# Altium project USBtoCANF3.PrjPCB
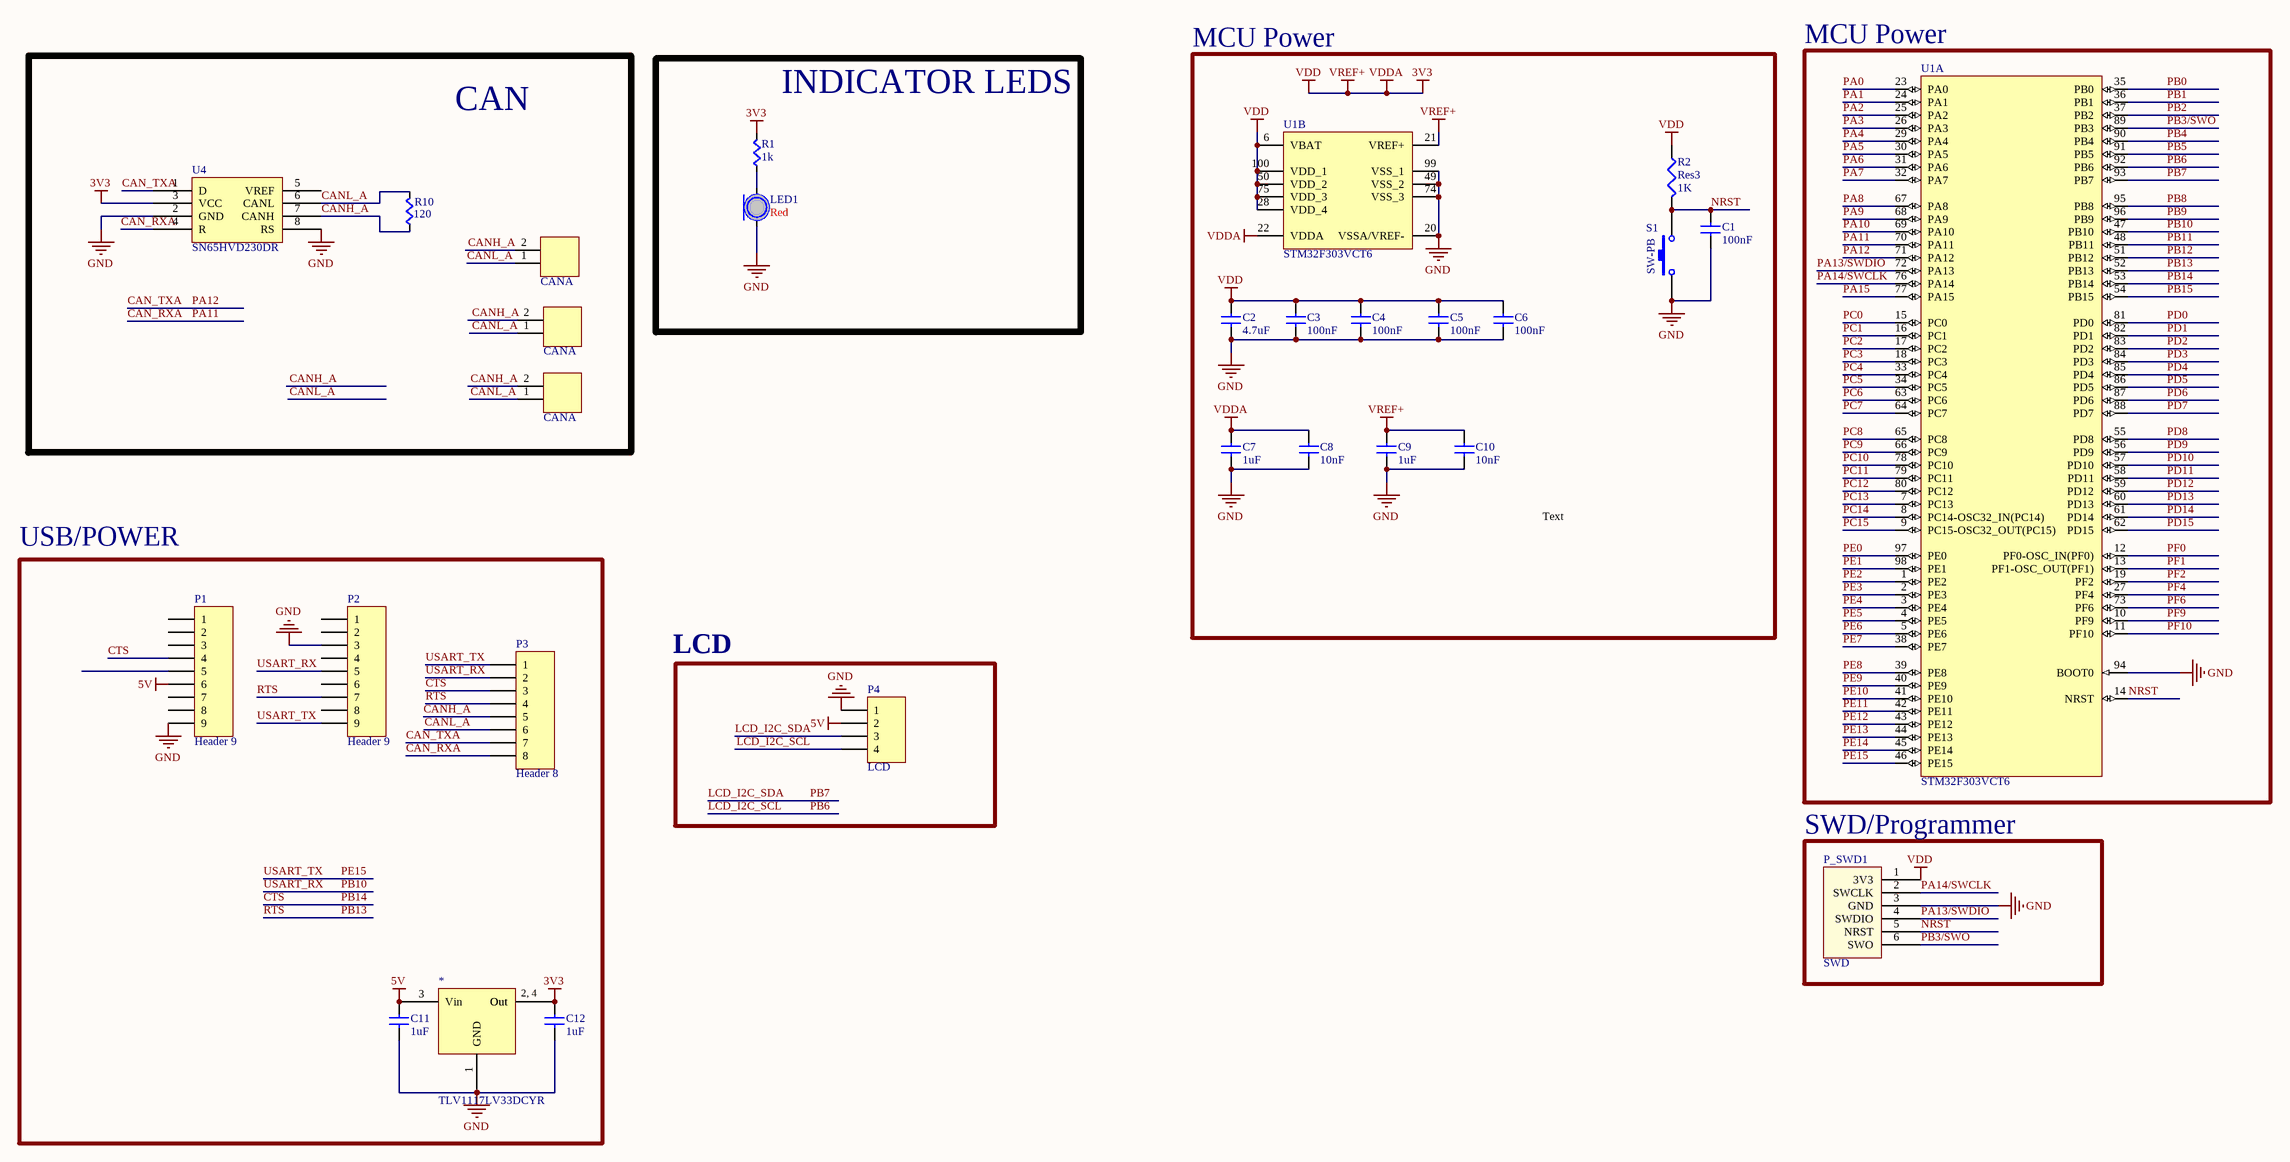
[diagram p0: USBtoCANF3.SchDoc]
1 sheet, 28 parts. Net scope: global (net labels, ports and power ports of the same name join across sheets).
Board file: USBtoCANF3.PcbDoc

## Sheet USBtoCANF3.SchDoc
size C

### Parts
(Parts that share a designator on the sheet are numbered #1, #2 ... from top to bottom, then left to right.)
*  TLV1117LV33DCYR  [SOT23-4N]
C1  value 100nF  [CAPC0603]  (hidden comment: Cap)
C2  value 4.7uF  [CAPC0603]  (hidden comment: Cap)
C3  value 100nF  [CAPC0603]  (hidden comment: Cap)
C4  value 100nF  [CAPC0603]  (hidden comment: Cap)
C5  value 100nF  [CAPC0603]  (hidden comment: Cap)
C6  value 100nF  [CAPC0603]  (hidden comment: Cap)
C7  value 1uF  [CAPC0603]  (hidden comment: Cap)
C8  value 10nF  [CAPC0603]  (hidden comment: Cap)
C9  value 1uF  [CAPC0603]  (hidden comment: Cap)
C10  value 10nF  [CAPC0603]  (hidden comment: Cap)
C11  value 1uF  [CAPC0603]  (hidden comment: Cap)
C12  value 1uF  [CAPC0603]  (hidden comment: Cap)
CANA#1  2-pin Horz Sherlock  [MOLEX-HDR-1X2-SHERLOCK-HORZ]  (value not drawn)
CANA#2  2-pin Horz Sherlock  [MOLEX-HDR-1X2-SHERLOCK-HORZ]  (value not drawn)
CANA#3  2-pin Horz Sherlock  [MOLEX-HDR-1X2-SHERLOCK-HORZ]  (value not drawn)
LED1  Color: Red  [LED0603]  (hidden comment: LED)
P1  Header 9  [HDR1X9]
P2  Header 9  [HDR1X9]
P3  Header 8  [HDR1X8]
P4  LCD  [HDR1X4]
P_SWD1  SWD  [SWD_STM32]
R1  value 1k  [RES0603]  (hidden comment: Res)
R2  Res3  value 1K  [J1-0603]
R10  value 120  [RES0603]  (hidden comment: Res)
S1  SW-PB  [SW PB]
U1  STM32F303VCT6  [STM-LQFP100_N]  (parts A,B of 2)
U4  SN65HVD230DR  [SOIC-8pin]

### Blocks framed on the sheet
CAN: CANA#1-CANA#3 R10 U4
INDICATOR LEDS: LED1 R1
MCU Power: C1-C10 R2 S1 U1
MCU Power: U1
USB/POWER: * C11 C12 P1-P3
LCD: P4
SWD/Programmer: P_SWD1

### Nets
3V3: *.2(Out) *.4(Out) C2.1(A) C3.1(A) C4.1(A) C5.1(A) C6.1(A) C7.1(A) C8.1(A) C9.1(A) C10.1(A) C12.1(A) P_SWD1.1(3V3) R1.1(A) R2.1 U1.6(VBAT) U1.21(VREF+) U1.22(VDDA) U1.28(VDD_4) U1.50(VDD_2) U1.75(VDD_3) U1.100(VDD_1) U4.3(VCC)  [also labelled VDD, VDDA, VREF+]
5V: *.3(Vin) C11.1(A) P1.6 P4.2
GND: *.1(GND) C1.2(B) C2.2(B) C3.2(B) C4.2(B) C5.2(B) C6.2(B) C7.2(B) C8.2(B) C9.2(B) C10.2(B) C11.2(B) C12.2(B) LED1.C P1.9 P2.3 P4.1 P_SWD1.3(GND) S1.1 U1.20(VSSA/VREF-) U1.49(VSS_2) U1.74(VSS_3) U1.94(BOOT0) U1.99(VSS_1) U4.2(GND) U4.8(RS)
CAN_RXA: P3.8 U1.70(PA11) U4.4(R)  [also labelled PA11]
CAN_TXA: P3.7 U1.71(PA12) U4.1(D)  [also labelled PA12]
CANH_A: CANA#1.2 CANA#2.2 CANA#3.2 P3.5 R10.2(B) U4.7(CANH)
CANL_A: CANA#1.1 CANA#2.1 CANA#3.1 P3.6 R10.1(A) U4.6(CANL)
CTS: P1.4 P3.3 U1.53(PB14)  [also labelled PB14]
LCD_I2C_SCL: P4.4 U1.92(PB6)  [also labelled PB6]
LCD_I2C_SDA: P4.3 U1.93(PB7)  [also labelled PB7]
NRST: C1.1(A) P_SWD1.5(NRST) R2.2 S1.2 U1.14(NRST)
PA0: U1.23(PA0)
PA1: U1.24(PA1)
PA2: U1.25(PA2)
PA3: U1.26(PA3)
PA4: U1.29(PA4)
PA5: U1.30(PA5)
PA6: U1.31(PA6)
PA7: U1.32(PA7)
PA8: U1.67(PA8)
PA9: U1.68(PA9)
PA10: U1.69(PA10)
PA13/SWDIO: P_SWD1.4(SWDIO) U1.72(PA13)
PA14/SWCLK: P_SWD1.2(SWCLK) U1.76(PA14)
PA15: U1.77(PA15)
PB0: U1.35(PB0)
PB1: U1.36(PB1)
PB2: U1.37(PB2)
PB3/SWO: P_SWD1.6(SWO) U1.89(PB3)
PB4: U1.90(PB4)
PB5: U1.91(PB5)
PB8: U1.95(PB8)
PB9: U1.96(PB9)
PB10: P2.5 P3.2 U1.47(PB10)  [also labelled USART_RX]
PB11: U1.48(PB11)
PB12: U1.51(PB12)
PB13: P2.7 P3.4 U1.52(PB13)  [also labelled RTS]
PB15: U1.54(PB15)
PC0: U1.15(PC0)
PC1: U1.16(PC1)
PC2: U1.17(PC2)
PC3: U1.18(PC3)
PC4: U1.33(PC4)
PC5: U1.34(PC5)
PC6: U1.63(PC6)
PC7: U1.64(PC7)
PC8: U1.65(PC8)
PC9: U1.66(PC9)
PC10: U1.78(PC10)
PC11: U1.79(PC11)
PC12: U1.80(PC12)
PC13: U1.7(PC13)
PC14: U1.8(PC14-OSC32_IN(PC14))
PC15: U1.9(PC15-OSC32_OUT(PC15))
PD0: U1.81(PD0)
PD1: U1.82(PD1)
PD2: U1.83(PD2)
PD3: U1.84(PD3)
PD4: U1.85(PD4)
PD5: U1.86(PD5)
PD6: U1.87(PD6)
PD7: U1.88(PD7)
PD8: U1.55(PD8)
PD9: U1.56(PD9)
PD10: U1.57(PD10)
PD11: U1.58(PD11)
PD12: U1.59(PD12)
PD13: U1.60(PD13)
PD14: U1.61(PD14)
PD15: U1.62(PD15)
PE0: U1.97(PE0)
PE1: U1.98(PE1)
PE2: U1.1(PE2)
PE3: U1.2(PE3)
PE4: U1.3(PE4)
PE5: U1.4(PE5)
PE6: U1.5(PE6)
PE7: U1.38(PE7)
PE8: U1.39(PE8)
PE9: U1.40(PE9)
PE10: U1.41(PE10)
PE11: U1.42(PE11)
PE12: U1.43(PE12)
PE13: U1.44(PE13)
PE14: U1.45(PE14)
PE15: P2.9 P3.1 U1.46(PE15)  [also labelled USART_TX]
PF0: U1.12(PF0-OSC_IN(PF0))
PF1: U1.13(PF1-OSC_OUT(PF1))
PF2: U1.19(PF2)
PF4: U1.27(PF4)
PF6: U1.73(PF6)
PF9: U1.10(PF9)
PF10: U1.11(PF10)
NetLED1_A: LED1.A R1.2(B)

Not connected (* = marked no-connect by the designer): P1 1 2 3 5 7 8; P2 1 2 4 6 8; U4 5(VREF)

### Notes on the sheet
- Text
- (in symbol TLV1117LV33DCYR) 2, 4

### Library data of the parts
* = TLV1117LV33DCYR: IC REG LINEAR 3.3V 1A SOT223-4; Digi-Key Part Number: 296-28778-1-ND
CANA#1-CANA#3 = MOLEX-HDR-1x2-SHERLOCK_RA: Header, Molex, 2mm Pitch Sherlock Header, Single Row, Horizontal, 2 Circuits, Length 3.3mm,  0353630260; Manufacturer: Molex Inc; Manufacturer Part Number: 0353630260; Supplier Part Number 1: WM18931-ND; Supplier 1: Digi-Key
P1 P2 = Header 9: Header, 9-Pin; LatestRevisionDate: 17-Jul-2002; LatestRevisionNote: Re-released for DXP Platform.; Publisher: Altium Limited
P3 = Header 8: Header, 8-Pin; LatestRevisionDate: 17-Jul-2002; LatestRevisionNote: Re-released for DXP Platform.; Publisher: Altium Limited
P4 = Header 4: Header, 4-Pin; LatestRevisionDate: 17-Jul-2002; LatestRevisionNote: Re-released for DXP Platform.; Publisher: Altium Limited
P_SWD1 = SWD_STM32: SWD connector matching the pinout on STM Discovery Boards
R2 = Res3: Resistor; Published: 8-Jun-2000; LatestRevisionDate: 29-May-2009; LatestRevisionNote: IPC-7351 Footprint Added.; PackageReference: J1-0603; Publisher: Altium Limited; PackageDescription: Chip Resistor
S1 = SW-PB: DIGIKEY SW400-ND; Published: 24-Mar-1999; LatestRevisionDate: 17-Jul-2002; LatestRevisionNote: Re-released for DXP Platform.; Publisher: Altium Limited
U1 = STM32F303VCT6: ARM Cortex-M4 32-bit MCU, 256 KB Flash, 40 KB Internal RAM, 87 I/Os, 100-pin LQFP, -40 to 85 degC, Tray; D/A Converter: 2x12-bit (2 Channel); FLASH Size (Prog) (kB): 256; I/Os (High Current): 87; Internal RAM Size (kB): 40; Operating Frequency(F) (Processor speed) (MHz): 72; Supply Voltage(Vcc) min (V): 2; DatasheetVersion: Rev. 6; PackageVersion: Rev. 1, 06/2013; PackageReference: LQFP100; PackageDescription: 100-Pin Low Profile Quad Flat Package, 14 x 14 mm Body, 0.5 mm Pitch; Supplier 1: Digi-Key; Supplier Part Number 1: 497-13233-ND; Supplier 2: Farnell; Supplier Part Number 2: 2215110; Supplier 3: Newark; Supplier Part Number 3: 43W6527; Supplier 4: Newark; Supplier Part Number 4: 46W2194; Supplier 5: Mouser; Supplier Part Number 5: 511-STM32F303VCT6; Core: ARM Cortex-M4; Packing: Tray; Mounting Technology: Surface Mount; PartNumber: STM32F303VCT6; ComponentLink1Description: Manufacturer URL; ComponentLink1URL: http://www.st.com/web/en/home.html; ComponentLink2Description: Datasheet; ComponentLink2URL: http://www.st.com/st-web-ui/static/active/en/resource/technical/document/datasheet/DM00058181.pdf; ComponentLink3Description: Package Specification; ComponentLink3URL: http://www.st.com/st-web-ui/static/active/en/resource/technical/document/data_brief/DM00071938.pdf
U4 = SN65HVD230DR: IC TXRX CAN 1MBPS 3.3V 8SOIC; Supplier 1: Digi-Key; Supplier Part Numbe 1: 296-11654-1-ND
C1-C12 = Cap: Supplier 1: Digi-Key; Supplier Part Number 1: 1276-1000-1-ND
LED1 = LED: Supplier 1: Digi-Key; Supplier Part Number 1: 754-1122-1-ND
R1 R10 = Res: Supplier 1: Digi-Key; Supplier Part Number 1: RMCF0603JT10K0CT-ND